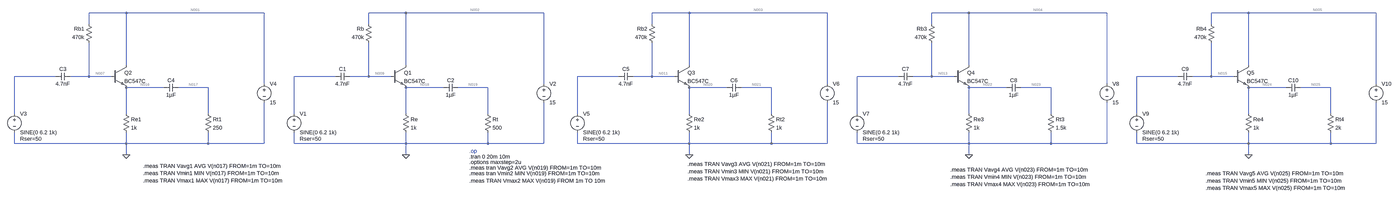
[diagram p0: schematic SPOJ-SZC-SIMULACIJA.asc, whole sheet]
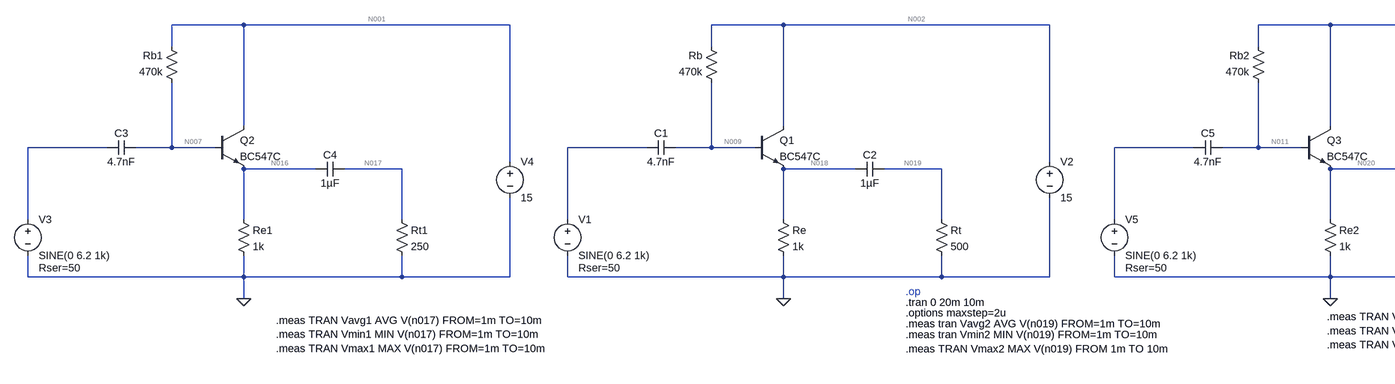
[diagram p1: schematic SPOJ-SZC-SIMULACIJA.asc, part, row 1 of 1, column 1 of 2]
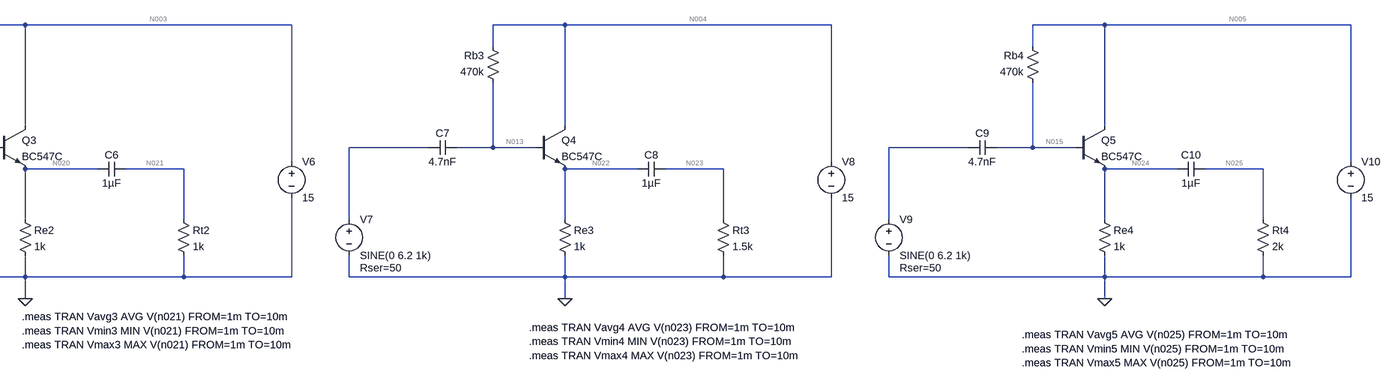
[diagram p2: schematic SPOJ-SZC-SIMULACIJA.asc, part, row 1 of 1, column 2 of 2]
SPOJ-SZC-SIMULACIJA.asc, the LTspice schematic file:
Version 4.1
SHEET 1 4536 680
WIRE -944 -128 -1104 -128
WIRE -352 -128 -944 -128
WIRE 256 -128 96 -128
WIRE 848 -128 256 -128
WIRE 1472 -128 1312 -128
WIRE 2064 -128 1472 -128
WIRE 2672 -128 2512 -128
WIRE 3264 -128 2672 -128
WIRE 3872 -128 3712 -128
WIRE 4464 -128 3872 -128
WIRE -1104 -80 -1104 -128
WIRE 96 -80 96 -128
WIRE 1312 -80 1312 -128
WIRE 2512 -80 2512 -128
WIRE 3712 -80 3712 -128
WIRE -944 96 -944 -128
WIRE 256 96 256 -128
WIRE 1472 96 1472 -128
WIRE 2672 96 2672 -128
WIRE 3872 96 3872 -128
WIRE -1248 144 -1424 144
WIRE -1104 144 -1104 0
WIRE -1104 144 -1184 144
WIRE -1008 144 -1104 144
WIRE -48 144 -224 144
WIRE 96 144 96 0
WIRE 96 144 16 144
WIRE 192 144 96 144
WIRE 1168 144 992 144
WIRE 1312 144 1312 0
WIRE 1312 144 1232 144
WIRE 1408 144 1312 144
WIRE 2368 144 2192 144
WIRE 2512 144 2512 0
WIRE 2512 144 2432 144
WIRE 2608 144 2512 144
WIRE 3568 144 3392 144
WIRE 3712 144 3712 0
WIRE 3712 144 3632 144
WIRE 3808 144 3712 144
WIRE -352 176 -352 -128
WIRE 848 176 848 -128
WIRE 2064 176 2064 -128
WIRE 3264 176 3264 -128
WIRE 4464 176 4464 -128
WIRE -784 192 -944 192
WIRE -592 192 -720 192
WIRE 416 192 256 192
WIRE 608 192 480 192
WIRE 1632 192 1472 192
WIRE 1824 192 1696 192
WIRE 2832 192 2672 192
WIRE 3024 192 2896 192
WIRE 4032 192 3872 192
WIRE 4224 192 4096 192
WIRE -1424 304 -1424 144
WIRE -944 304 -944 192
WIRE -592 304 -592 192
WIRE -224 304 -224 144
WIRE 256 304 256 192
WIRE 608 304 608 192
WIRE 992 304 992 144
WIRE 1472 304 1472 192
WIRE 1824 304 1824 192
WIRE 2192 304 2192 144
WIRE 2672 304 2672 192
WIRE 3024 304 3024 192
WIRE 3392 304 3392 144
WIRE 3872 304 3872 192
WIRE 4224 304 4224 192
WIRE -1424 432 -1424 384
WIRE -944 432 -944 384
WIRE -944 432 -1424 432
WIRE -592 432 -592 384
WIRE -592 432 -944 432
WIRE -352 432 -352 256
WIRE -352 432 -592 432
WIRE -224 432 -224 384
WIRE 256 432 256 384
WIRE 256 432 -224 432
WIRE 608 432 608 384
WIRE 608 432 256 432
WIRE 848 432 848 256
WIRE 848 432 608 432
WIRE 992 432 992 384
WIRE 1472 432 1472 384
WIRE 1472 432 992 432
WIRE 1824 432 1824 384
WIRE 1824 432 1472 432
WIRE 2064 432 2064 256
WIRE 2064 432 1824 432
WIRE 2192 432 2192 384
WIRE 2672 432 2672 384
WIRE 2672 432 2192 432
WIRE 3024 432 3024 384
WIRE 3024 432 2672 432
WIRE 3264 432 3264 256
WIRE 3264 432 3024 432
WIRE 3392 432 3392 384
WIRE 3872 432 3872 384
WIRE 3872 432 3392 432
WIRE 4224 432 4224 384
WIRE 4224 432 3872 432
WIRE 4464 432 4464 256
WIRE 4464 432 4224 432
WIRE -944 480 -944 432
WIRE 256 480 256 432
WIRE 1472 480 1472 432
WIRE 2672 480 2672 432
WIRE 3872 480 3872 432
FLAG 256 480 0
FLAG -944 480 0
FLAG 1472 480 0
FLAG 2672 480 0
FLAG 3872 480 0
SYMBOL npn 192 96 R0
SYMATTR InstName Q1
SYMATTR Value BC547C
SYMBOL res 240 288 R0
SYMATTR InstName Re
SYMATTR Value 1k
SYMBOL res 112 16 R180
WINDOW 0 36 76 Left 2
WINDOW 3 36 40 Left 2
SYMATTR InstName Rb
SYMATTR Value 470k
SYMBOL cap 16 128 R90
WINDOW 0 0 32 VBottom 2
WINDOW 3 32 32 VTop 2
SYMATTR InstName C1
SYMATTR Value 4.7nF
SYMBOL cap 480 176 R90
WINDOW 0 0 32 VBottom 2
WINDOW 3 32 32 VTop 2
SYMATTR InstName C2
SYMATTR Value 1µF
SYMBOL res 592 288 R0
SYMATTR InstName Rt
SYMATTR Value 500
SYMBOL voltage -224 288 R0
WINDOW 123 0 0 Left 0
WINDOW 39 24 124 Left 2
SYMATTR SpiceLine Rser=50
SYMATTR InstName V1
SYMATTR Value SINE(0 6.2 1k)
SYMBOL voltage 848 160 R0
WINDOW 123 0 0 Left 0
WINDOW 39 0 0 Left 0
SYMATTR InstName V2
SYMATTR Value 15
SYMBOL npn -1008 96 R0
SYMATTR InstName Q2
SYMATTR Value BC547C
SYMBOL res -960 288 R0
SYMATTR InstName Re1
SYMATTR Value 1k
SYMBOL res -1088 16 R180
WINDOW 0 36 76 Left 2
WINDOW 3 36 40 Left 2
SYMATTR InstName Rb1
SYMATTR Value 470k
SYMBOL cap -1184 128 R90
WINDOW 0 0 32 VBottom 2
WINDOW 3 32 32 VTop 2
SYMATTR InstName C3
SYMATTR Value 4.7nF
SYMBOL cap -720 176 R90
WINDOW 0 0 32 VBottom 2
WINDOW 3 32 32 VTop 2
SYMATTR InstName C4
SYMATTR Value 1µF
SYMBOL res -608 288 R0
SYMATTR InstName Rt1
SYMATTR Value 250
SYMBOL voltage -1424 288 R0
WINDOW 123 0 0 Left 0
WINDOW 39 24 124 Left 2
SYMATTR SpiceLine Rser=50
SYMATTR InstName V3
SYMATTR Value SINE(0 6.2 1k)
SYMBOL voltage -352 160 R0
WINDOW 123 0 0 Left 0
WINDOW 39 0 0 Left 0
SYMATTR InstName V4
SYMATTR Value 15
SYMBOL npn 1408 96 R0
SYMATTR InstName Q3
SYMATTR Value BC547C
SYMBOL res 1456 288 R0
SYMATTR InstName Re2
SYMATTR Value 1k
SYMBOL res 1328 16 R180
WINDOW 0 36 76 Left 2
WINDOW 3 36 40 Left 2
SYMATTR InstName Rb2
SYMATTR Value 470k
SYMBOL cap 1232 128 R90
WINDOW 0 0 32 VBottom 2
WINDOW 3 32 32 VTop 2
SYMATTR InstName C5
SYMATTR Value 4.7nF
SYMBOL cap 1696 176 R90
WINDOW 0 0 32 VBottom 2
WINDOW 3 32 32 VTop 2
SYMATTR InstName C6
SYMATTR Value 1µF
SYMBOL res 1808 288 R0
SYMATTR InstName Rt2
SYMATTR Value 1k
SYMBOL voltage 992 288 R0
WINDOW 123 0 0 Left 0
WINDOW 39 24 124 Left 2
SYMATTR SpiceLine Rser=50
SYMATTR InstName V5
SYMATTR Value SINE(0 6.2 1k)
SYMBOL voltage 2064 160 R0
WINDOW 123 0 0 Left 0
WINDOW 39 0 0 Left 0
SYMATTR InstName V6
SYMATTR Value 15
SYMBOL npn 2608 96 R0
SYMATTR InstName Q4
SYMATTR Value BC547C
SYMBOL res 2656 288 R0
SYMATTR InstName Re3
SYMATTR Value 1k
SYMBOL res 2528 16 R180
WINDOW 0 36 76 Left 2
WINDOW 3 36 40 Left 2
SYMATTR InstName Rb3
SYMATTR Value 470k
SYMBOL cap 2432 128 R90
WINDOW 0 0 32 VBottom 2
WINDOW 3 32 32 VTop 2
SYMATTR InstName C7
SYMATTR Value 4.7nF
SYMBOL cap 2896 176 R90
WINDOW 0 0 32 VBottom 2
WINDOW 3 32 32 VTop 2
SYMATTR InstName C8
SYMATTR Value 1µF
SYMBOL res 3008 288 R0
SYMATTR InstName Rt3
SYMATTR Value 1.5k
SYMBOL voltage 2192 288 R0
WINDOW 123 0 0 Left 0
WINDOW 39 24 124 Left 2
SYMATTR SpiceLine Rser=50
SYMATTR InstName V7
SYMATTR Value SINE(0 6.2 1k)
SYMBOL voltage 3264 160 R0
WINDOW 123 0 0 Left 0
WINDOW 39 0 0 Left 0
SYMATTR InstName V8
SYMATTR Value 15
SYMBOL npn 3808 96 R0
SYMATTR InstName Q5
SYMATTR Value BC547C
SYMBOL res 3856 288 R0
SYMATTR InstName Re4
SYMATTR Value 1k
SYMBOL res 3728 16 R180
WINDOW 0 36 76 Left 2
WINDOW 3 36 40 Left 2
SYMATTR InstName Rb4
SYMATTR Value 470k
SYMBOL cap 3632 128 R90
WINDOW 0 0 32 VBottom 2
WINDOW 3 32 32 VTop 2
SYMATTR InstName C9
SYMATTR Value 4.7nF
SYMBOL cap 4096 176 R90
WINDOW 0 0 32 VBottom 2
WINDOW 3 32 32 VTop 2
SYMATTR InstName C10
SYMATTR Value 1µF
SYMBOL res 4208 288 R0
SYMATTR InstName Rt4
SYMATTR Value 2k
SYMBOL voltage 3392 288 R0
WINDOW 123 0 0 Left 0
WINDOW 39 24 124 Left 2
SYMATTR SpiceLine Rser=50
SYMATTR InstName V9
SYMATTR Value SINE(0 6.2 1k)
SYMBOL voltage 4464 160 R0
WINDOW 123 0 0 Left 0
WINDOW 39 0 0 Left 0
SYMATTR InstName V10
SYMATTR Value 15
TEXT 528 464 Left 2 ;.op
TEXT 528 488 Left 2 !.tran 0 20m 10m
TEXT 528 512 Left 2 !.options maxstep=2u
TEXT 528 536 Left 2 !.meas tran Vavg2 AVG V(n019) FROM=1m TO=10m
TEXT 528 560 Left 2 !.meas tran Vmin2 MIN V(n019) FROM=1m TO=10m\n.meas TRAN Vmax2 MAX V(n019) FROM 1m TO 10m
TEXT -872 528 Left 2 !.meas TRAN Vavg1 AVG V(n017) FROM=1m TO=10m\n.meas TRAN Vmin1 MIN V(n017) FROM=1m TO=10m\n.meas TRAN Vmax1 MAX V(n017) FROM=1m TO=10m
TEXT 1464 520 Left 2 !.meas TRAN Vavg3 AVG V(n021) FROM=1m TO=10m\n.meas TRAN Vmin3 MIN V(n021) FROM=1m TO=10m\n.meas TRAN Vmax3 MAX V(n021) FROM=1m TO=10m
TEXT 2592 544 Left 2 !.meas TRAN Vavg4 AVG V(n023) FROM=1m TO=10m\n.meas TRAN Vmin4 MIN V(n023) FROM=1m TO=10m\n.meas TRAN Vmax4 MAX V(n023) FROM=1m TO=10m
TEXT 3688 560 Left 2 !.meas TRAN Vavg5 AVG V(n025) FROM=1m TO=10m\n.meas TRAN Vmin5 MIN V(n025) FROM=1m TO=10m\n.meas TRAN Vmax5 MAX V(n025) FROM=1m TO=10m

The netlist it stands for:
* SPOJ-SZC-SIMULACIJA.asc
Q1 N002 N009 N018 0 BC547C
Re N018 0 1k
Rb N009 N002 470k
C1 N009 N008 4.7nF
C2 N019 N018 1µF
Rt N019 0 500
V1 N008 0 SINE(0 6.2 1k) Rser=50
V2 N002 0 15
Q2 N001 N007 N016 0 BC547C
Re1 N016 0 1k
Rb1 N007 N001 470k
C3 N007 N006 4.7nF
C4 N017 N016 1µF
Rt1 N017 0 250
V3 N006 0 SINE(0 6.2 1k) Rser=50
V4 N001 0 15
Q3 N003 N011 N020 0 BC547C
Re2 N020 0 1k
Rb2 N011 N003 470k
C5 N011 N010 4.7nF
C6 N021 N020 1µF
Rt2 N021 0 1k
V5 N010 0 SINE(0 6.2 1k) Rser=50
V6 N003 0 15
Q4 N004 N013 N022 0 BC547C
Re3 N022 0 1k
Rb3 N013 N004 470k
C7 N013 N012 4.7nF
C8 N023 N022 1µF
Rt3 N023 0 1.5k
V7 N012 0 SINE(0 6.2 1k) Rser=50
V8 N004 0 15
Q5 N005 N015 N024 0 BC547C
Re4 N024 0 1k
Rb4 N015 N005 470k
C9 N015 N014 4.7nF
C10 N025 N024 1µF
Rt4 N025 0 2k
V9 N014 0 SINE(0 6.2 1k) Rser=50
V10 N005 0 15
.model NPN NPN
.model PNP PNP
.lib standard.bjt
* .op
.tran 0 20m 10m
.options maxstep=2u
.meas tran Vavg2 AVG V(n019) FROM=1m TO=10m
.meas tran Vmin2 MIN V(n019) FROM=1m TO=10m
.meas TRAN Vmax2 MAX V(n019) FROM 1m TO 10m
.meas TRAN Vavg1 AVG V(n017) FROM=1m TO=10m
.meas TRAN Vmin1 MIN V(n017) FROM=1m TO=10m
.meas TRAN Vmax1 MAX V(n017) FROM=1m TO=10m
.meas TRAN Vavg3 AVG V(n021) FROM=1m TO=10m
.meas TRAN Vmin3 MIN V(n021) FROM=1m TO=10m
.meas TRAN Vmax3 MAX V(n021) FROM=1m TO=10m
.meas TRAN Vavg4 AVG V(n023) FROM=1m TO=10m
.meas TRAN Vmin4 MIN V(n023) FROM=1m TO=10m
.meas TRAN Vmax4 MAX V(n023) FROM=1m TO=10m
.meas TRAN Vavg5 AVG V(n025) FROM=1m TO=10m
.meas TRAN Vmin5 MIN V(n025) FROM=1m TO=10m
.meas TRAN Vmax5 MAX V(n025) FROM=1m TO=10m
.backanno
.end

* Results of the author's LTspice run, read from the files saved beside the schematic
* Operating Point, zero values left out:
*   V(n001) = 15 V
*   V(n002) = 15 V
*   V(n003) = 15 V
*   V(n004) = 15 V
*   V(n005) = 15 V
*   V(n007) = 8.022 V
*   V(n009) = 8.022 V
*   V(n011) = 8.022 V
*   V(n013) = 8.022 V
*   V(n015) = 8.022 V
*   V(n016) = 7.349 V
*   V(n018) = 7.349 V
*   V(n020) = 7.349 V
*   V(n022) = 7.349 V
*   V(n024) = 7.349 V
*   I(Rb) = -14.85 µA
*   I(Rb1) = -14.85 µA
*   I(Rb2) = -14.85 µA
*   I(Rb3) = -14.85 µA
*   I(Rb4) = -14.85 µA
*   I(Re) = 7.349 mA
*   I(Re1) = 7.349 mA
*   I(Re2) = 7.349 mA
*   I(Re3) = 7.349 mA
*   I(Re4) = 7.349 mA
*   I(V10) = -7.349 mA
*   I(V2) = -7.349 mA
*   I(V4) = -7.349 mA
*   I(V6) = -7.349 mA
*   I(V8) = -7.349 mA
*   Ib(Q1) = 14.85 µA
*   Ib(Q2) = 14.85 µA
*   Ib(Q3) = 14.85 µA
*   Ib(Q4) = 14.85 µA
*   Ib(Q5) = 14.85 µA
*   Ic(Q1) = 7.334 mA
*   Ic(Q2) = 7.334 mA
*   Ic(Q3) = 7.334 mA
*   Ic(Q4) = 7.334 mA
*   Ic(Q5) = 7.334 mA
*   Ie(Q1) = -7.349 mA
*   Ie(Q2) = -7.349 mA
*   Ie(Q3) = -7.349 mA
*   Ie(Q4) = -7.349 mA
*   Ie(Q5) = -7.349 mA
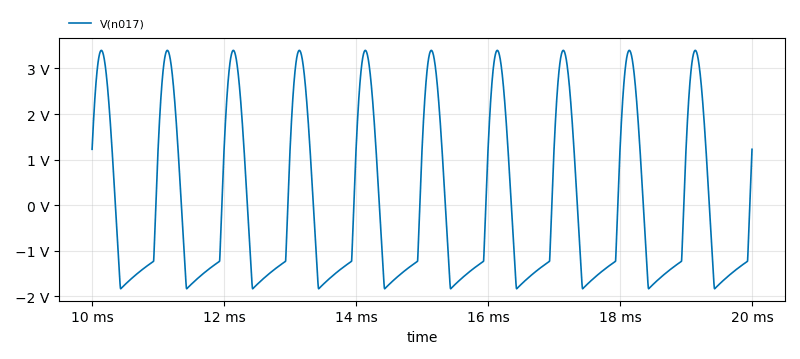
[diagram p3: Transient Analysis of SPOJ-SZC-SIMULACIJA.asc, plotted from the saved traces]
* Transient Analysis, 1 run:
*   V(n017): min -1.835 V, max 3.397 V, average -18.29 µV, rms 1.892 V, last 1.226 V
* From the log:
*   vavg2: AVG(V(n019) )=-2.38619024381e-05 FROM 0.001 TO 0.01
*   vmin2: MIN(V(n019) )=-2.82575511932 FROM 0.001 TO 0.01
*   vmax2: MAX(V(n019) )=4.45739746094 FROM 0.001 TO 0.01
*   vavg1: AVG(V(n017) )=-1.06651677672e-05 FROM 0.001 TO 0.01
*   vmin1: MIN(V(n017) )=-1.83513593674 FROM 0.001 TO 0.01
*   vmax1: MAX(V(n017) )=3.39707016945 FROM 0.001 TO 0.01
*   vavg3: AVG(V(n021) )=-9.16094209188e-05 FROM 0.001 TO 0.01
*   vmin3: MIN(V(n021) )=-3.91111683846 FROM 0.001 TO 0.01
*   vmax3: MAX(V(n021) )=5.2881603241 FROM 0.001 TO 0.01
*   vavg4: AVG(V(n023) )=-0.000349497492559 FROM 0.001 TO 0.01
*   vmin4: MIN(V(n023) )=-4.51750850677 FROM 0.001 TO 0.01
*   vmax4: MAX(V(n023) )=5.6240901947 FROM 0.001 TO 0.01
*   vavg5: AVG(V(n025) )=-0.00103977728379 FROM 0.001 TO 0.01
*   vmin5: MIN(V(n025) )=-4.91643667221 FROM 0.001 TO 0.01
*   vmax5: MAX(V(n025) )=5.79607915878 FROM 0.001 TO 0.01